# Altium schematic sheet POWERSYSTEM.SchDoc: DARKYDEN_POWERSYSTEM (part 1 of 3)
size Letter; ApprovedBy: APPROUVÉ PAR; Author: Harold Malbrouck; Organization: Cegep Limoilou; Address1: 1300, 8e Avenue; Address2: Québec, QC; Address3: Canada; Address4: G1J 5L5; Revision: Rev.A; SheetNumber: 17; SheetTotal: 23
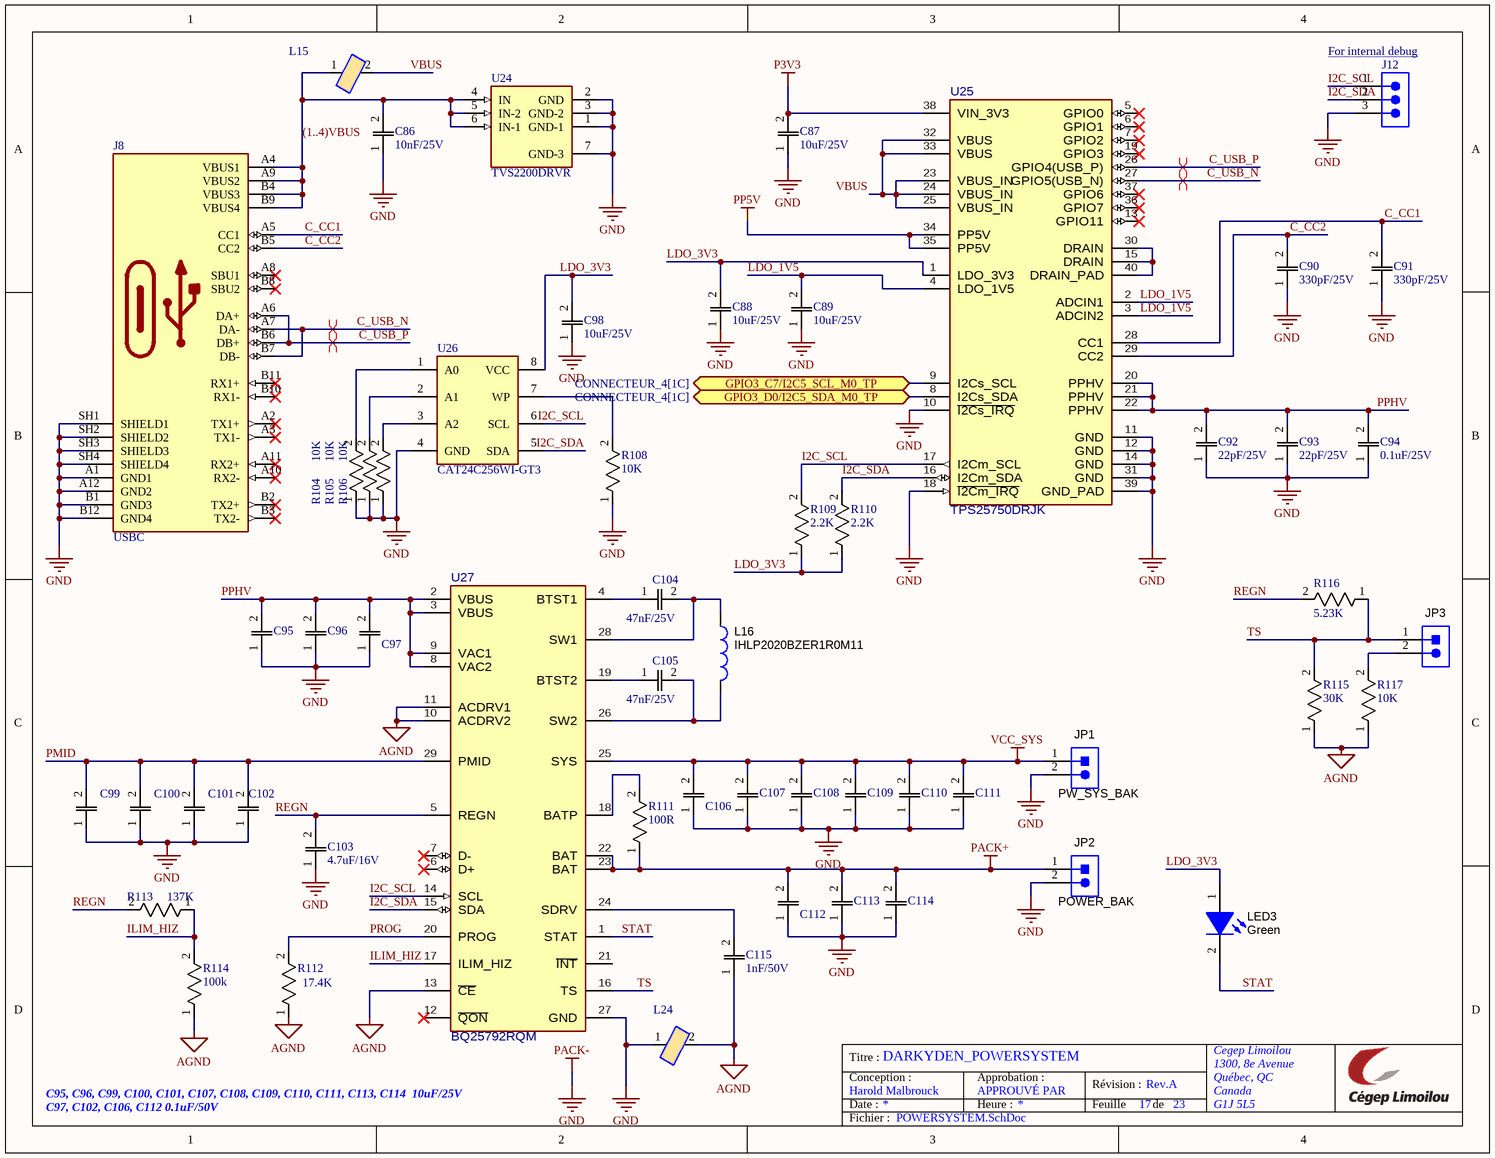
[diagram p0: POWERSYSTEM.SchDoc]

## Parts
C86  10nF/25V  [C0805]
C87  10uF/25V  [C0805]
C88  10uF/25V  [C0805]
C89  10uF/25V  [C0805]
C90  330pF/25V  [C0805]
C91  330pF/25V  [C0805]
C92  22pF/25V  [c0805]
C93  22pF/25V  [c0805]
C94  0.1uF/25V  [c0805]
C95  10uF/25V  [C0805]  (value not drawn)
C96  10uF/25V  [C0805]  (value not drawn)
C97  0.1uF/50V  [C0805]  (value not drawn)
C98  10uF/25V  [C0805]
C99  10uF/25V  [C0805]  (value not drawn)
C100  10uF/25V  [C0805]  (value not drawn)
C101  10uF/25V  [C0805]  (value not drawn)
C102  0.1uF/50V  [C0805]  (value not drawn)
C103  4.7uF/16V  [C0805]
C104  47nF/25V  [C0805]
C105  47nF/25V  [C0805]
C106  0.1uF/50V  [C0805]  (value not drawn)
C107  10uF/25V  [C0805]  (value not drawn)
C108  10uF/25V  [C0805]  (value not drawn)
C109  10uF/25V  [C0805]  (value not drawn)
C110  10uF/25V  [C0805]  (value not drawn)
C111  10uF/25V  [C0805]  (value not drawn)
C112  0.1uF/50V  [C0805]  (value not drawn)
C113  10uF/25V  [C0805]  (value not drawn)
C114  10uF/25V  [C0805]  (value not drawn)
C115  1nF/50V  [C0805]
J8  USBC  [USB_C]
J12  61300311121  [61300311121]  (value not drawn)
JP1  PW_SYS_BAK  [61300211121]
JP2  POWER_BAK  [61300211121]
JP3  TS  [61300211121]  (value not drawn)
L15  FBMJ2125HM210NT  [INDC2012X105N]  (value not drawn)
L16  IHLP2020BZER1R0M11  [IHLP-2020BZ]
L24  FBMJ2125HM210NT  [INDC2012X105N]  (value not drawn)
LED3  value Green  [LED_LTST-C190]  (hidden comment: LTST-C190GKT)
R104  10K  [RESC1608X55N]
R105  10K  [RESC1608X55N]
R106  10K  [RESC1608X55N]
R108  10K  [RESC1608X55N]
R109  2.2K  [RESC1608X55N]
R110  2.2K  [RESC1608X55N]
R111  100R  [RESC1608X55N]
R112  17.4K  [RESC1608X55N]
R113  137K  [RESC1608X55N]
R114  100k  [RESC1608X55N]
R115  30K  [RESC1608X55N]
R116  5.23K  [RESC1608X55N]
R117  10K  [RESC1608X55N]
U24  TVS2200DRVR  [SON65P200X200X80-7N]
U25  TPS25750DRJK  [RJK0038B-C01-MFG]
U26  CAT24C256WI-GT3  [SOIC127P600X175-8N]
U27  BQ25792RQM  [RQM0029A-MFG]

## Ports
GPIO3_C7/I2C5_SCL_M0_TP (bidir, see CONNECTEUR_4[1C]), GPIO3_D0/I2C5_SDA_M0_TP (bidir, see CONNECTEUR_4[1C])

## Nets
AGND: C115.1 L24.2 R112.1 R114.1 R115.1 R117.1 U27.10(ACDRV2) U27.11(ACDRV1) U27.13(~{CE})
GND: C86.1 C87.1 C88.1 C89.1 C90.1 C91.1 C92.1 C93.1 C94.1 C95.1 C96.1 C97.1 C98.1 C99.1 C100.1 C101.1 C102.1 C103.1 C106.1 C107.1 C108.1 C109.1 C110.1 C111.1 C112.1 C113.1 C114.1 J8.A1(GND1) J8.A12(GND2) J8.B1(GND3) J8.B12(GND4) J8.SH1(SHIELD1) J8.SH2(SHIELD2) J8.SH3(SHIELD3) J8.SH4(SHIELD4) J12.3 JP1.2 JP2.2 L24.1 R104.1 R105.1 R106.1 R108.1 U24.1(GND-1) U24.2(GND) U24.3(GND-2) U24.7(GND-3) U25.10(~{I2Cs_IRQ}) U25.11(GND) U25.12(GND) U25.14(GND) U25.18(~{I2Cm_IRQ}) U25.31(GND) U25.39(GND_PAD) U26.4(GND) U27.27(GND)  [also labelled PACK-]
P3V3: C87.2 U25.38(VIN_3V3)
PACK+: C112.2 C113.2 C114.2 JP2.1 R111.1 U27.22(BAT) U27.23(BAT)
PP5V: U25.34(PP5V) U25.35(PP5V)
VCC_SYS: C106.2 C107.2 C108.2 C109.2 C110.2 C111.2 JP1.1 U27.25(SYS)
(1..4)VBUS: C86.2 J8.A4(VBUS1) J8.A9(VBUS2) J8.B4(VBUS3) J8.B9(VBUS4) L15.1 U24.4(IN) U24.5(IN-2) U24.6(IN-1)
C_CC1: C91.2 J8.A5(CC1) U25.28(CC1)
C_CC2: C90.2 J8.B5(CC2) U25.29(CC2)
C_USB_N: J8.A7(DA-) J8.B7(DB-) U25.27(GPIO5(USB_N))
C_USB_P: J8.A6(DA+) J8.B6(DB+) U25.26(GPIO4(USB_P))
GPIO3_C7/I2C5_SCL_M0_TP: U25.9(I2Cs_SCL) ; port GPIO3_C7/I2C5_SCL_M0_TP
GPIO3_D0/I2C5_SDA_M0_TP: U25.8(I2Cs_SDA) ; port GPIO3_D0/I2C5_SDA_M0_TP
I2C_SCL: J12.1 R109.2 U25.17(I2Cm_SCL) U26.6(SCL) U27.14(SCL)
I2C_SDA: J12.2 R110.2 U25.16(I2Cm_SDA) U26.5(SDA) U27.15(SDA)
ILIM_HIZ: R113.1 R114.2 U27.17(ILIM_HIZ)
LDO_1V5: C89.2 U25.2(ADCIN1) U25.3(ADCIN2) U25.4(LDO_1V5)
LDO_3V3: C88.2 C98.2 LED3.1(A) R109.1 R110.1 U25.1(LDO_3V3) U26.8(VCC)
PMID: C99.2 C100.2 C101.2 C102.2 U27.29(PMID)
PPHV: C92.2 C93.2 C94.2 C95.2 C96.2 C97.2 U25.20(PPHV) U25.21(PPHV) U25.22(PPHV) U27.2(VBUS) U27.3(VBUS) U27.8(VAC2) U27.9(VAC1)
PROG: R112.2 U27.20(PROG)
REGN: C103.2 R113.2 R116.2 U27.5(REGN)
STAT: LED3.2(K) U27.1(STAT)
TS: JP3.1 R115.2 R116.1 U27.16(TS)
VBUS: L15.2 U25.23(VBUS_IN) U25.24(VBUS_IN) U25.25(VBUS_IN) U25.32(VBUS) U25.33(VBUS)
NetC104_1: C104.1 U27.4(BTST1)
NetC104_2: C104.2 L16.1 U27.28(SW1)
NetC105_1: C105.1 U27.19(BTST2)
NetC105_2: C105.2 L16.2 U27.26(SW2)
NetC115_2: C115.2 U27.24(SDRV)
NetJP3_2: JP3.2 R117.2
NetR104_2: R104.2 U26.1(A0)
NetR105_2: R105.2 U26.2(A1)
NetR106_2: R106.2 U26.3(A2)
NetR108_2: R108.2 U26.7(WP)
NetR111_2: R111.2 U27.18(BATP)
NetU25_15: U25.15(DRAIN) U25.30(DRAIN) U25.40(DRAIN_PAD)

Not connected (* = marked no-connect by the designer): J8 A2(TX1+)* A3(TX1-)* A8(SBU1)* A10(RX2-)* A11(RX2+)* B2(TX2+)* B3(TX2-)* B8(SBU2)* B10(RX1-)* B11(RX1+)*; U25 5(GPIO0)* 6(GPIO1)* 7(GPIO2)* 13(GPIO11)* 19(GPIO3)* 36(GPIO7)* 37(GPIO6)*; U27 6(D+)* 7(D-)* 12(~{QON})* 21(~{INT})

## Layout directives
differential pair: C_USB_N, C_USB_P

## Notes on the sheet
- (near J12) For internal debug
- C95, C96, C99, C100, C101, C107, C108, C109, C110, C111, C113, C114  10uF/25V
  C97, C102, C106, C112 0.1uF/50V
- Titre :
- Conception :
- Date :
- Approbation :
- Heure :
- Révision :
- Feuille
- de
- Fichier :